# Altium schematic sheet DRIVERv1.4.SchDoc
size A4
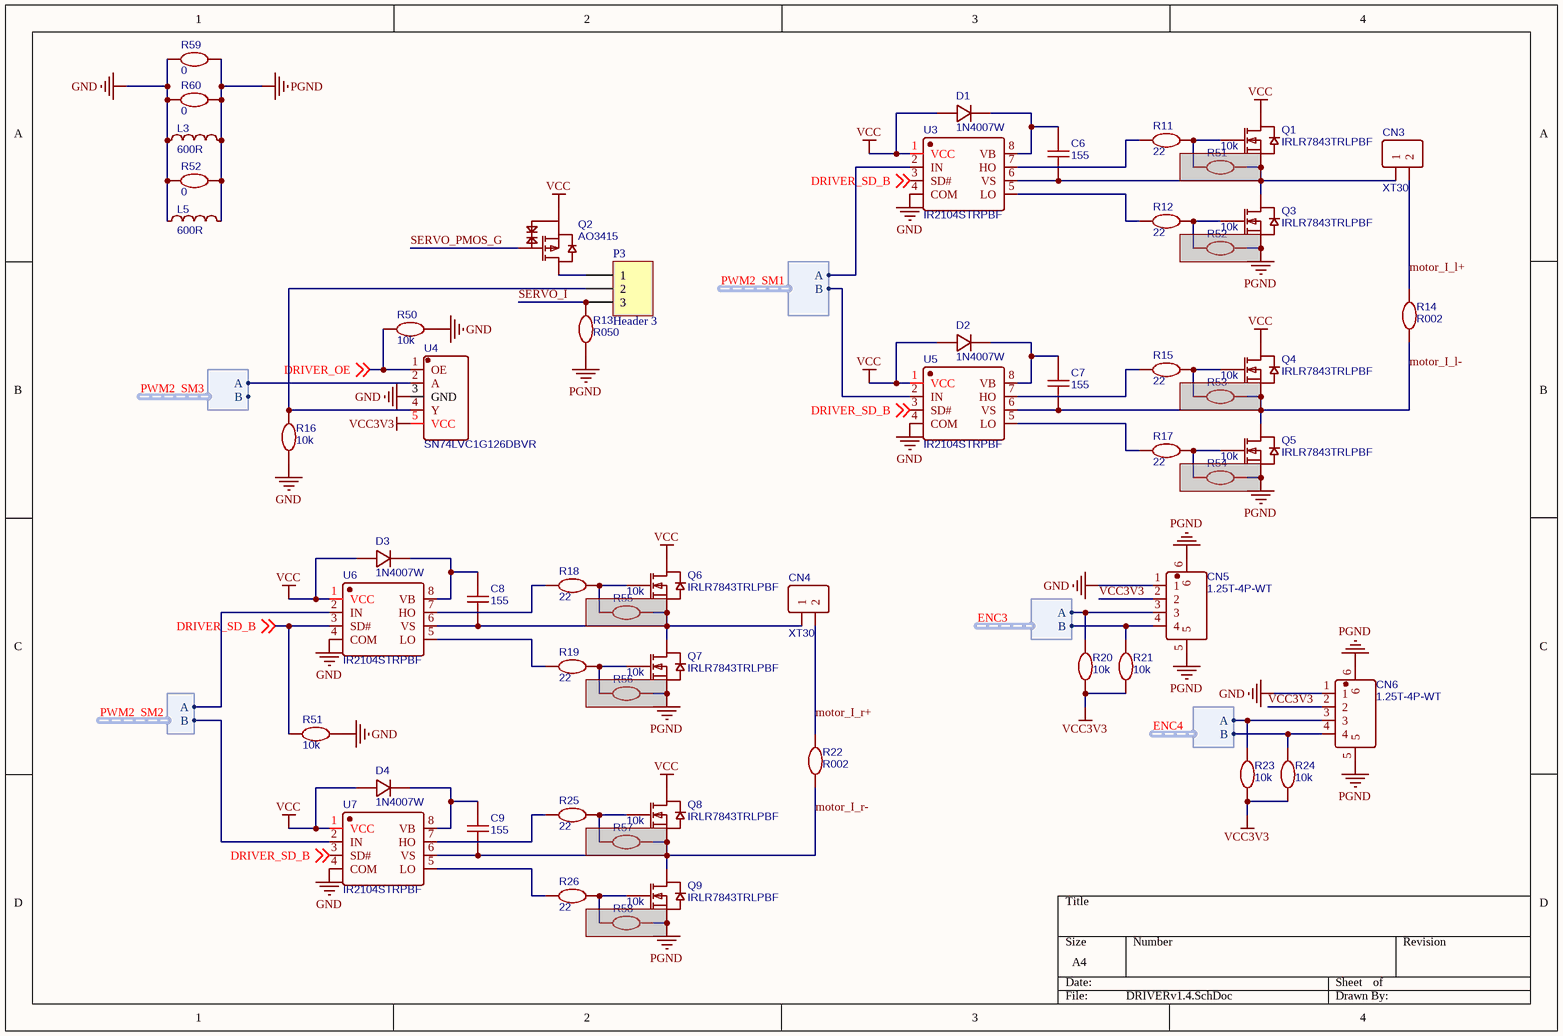
[diagram p0: DRIVERv1.4.SchDoc]

## Parts
(Parts that share a designator on the sheet are numbered #1, #2 ... from top to bottom, then left to right.)
C6  155  [C0603]
C7  155  [C0603]
C8  155  [C0603]
C9  155  [C0603]
CN3  XT30  [CONN-TH_XT30UPB-F]
CN4  XT30  [CONN-TH_XT30UPB-F]
CN5  1.25T-4P-WT  [CONN-SMD_4P-1.25P_1.25T-4P]
CN6  1.25T-4P-WT  [CONN-SMD_4P-1.25P_1.25T-4P]
D1  1N4007W  [SOD-123_L2.8-W1.8-LS3.7-RD]
D2  1N4007W  [SOD-123_L2.8-W1.8-LS3.7-RD]
D3  1N4007W  [SOD-123_L2.8-W1.8-LS3.7-RD]
D4  1N4007W  [SOD-123_L2.8-W1.8-LS3.7-RD]
L3  600R  [L0603]
L5  600R  [L0603]
P3  Header 3  [HDR1X3]
Q1  IRLR7843TRLPBF  [DPAK_L6.5-W6.0-P2.29-LS9.9-TL]
Q2  AO3415  [SOT-23-3_L2.9-W1.3-P1.90-LS2.4-BR]
Q3  IRLR7843TRLPBF  [DPAK_L6.5-W6.0-P2.29-LS9.9-TL]
Q4  IRLR7843TRLPBF  [DPAK_L6.5-W6.0-P2.29-LS9.9-TL]
Q5  IRLR7843TRLPBF  [DPAK_L6.5-W6.0-P2.29-LS9.9-TL]
Q6  IRLR7843TRLPBF  [DPAK_L6.5-W6.0-P2.29-LS9.9-TL]
Q7  IRLR7843TRLPBF  [DPAK_L6.5-W6.0-P2.29-LS9.9-TL]
Q8  IRLR7843TRLPBF  [DPAK_L6.5-W6.0-P2.29-LS9.9-TL]
Q9  IRLR7843TRLPBF  [DPAK_L6.5-W6.0-P2.29-LS9.9-TL]
R11  22  [R0603]
R12  22  [R0603]
R13  R050  [R2010]
R14  R002  [R2010]
R15  22  [R0603]
R16  10k  [R0603]
R17  22  [R0603]
R18  22  [R0603]
R19  22  [R0603]
R20  10k  [R0603]
R21  10k  [R0603]
R22  R002  [R2010]
R23  10k  [R0603]
R24  10k  [R0603]
R25  22  [R0603]
R26  22  [R0603]
R50  10k  [R0603]
R51#1  10k  [R0603]  (masked out: inside a compile mask, not in the netlist)
R51#2  10k  [R0603]
R52#1  0  [R0603]
R52#2  10k  [R0603]  (masked out: inside a compile mask, not in the netlist)
R53  10k  [R0603]  (masked out: inside a compile mask, not in the netlist)
R54  10k  [R0603]  (masked out: inside a compile mask, not in the netlist)
R55  10k  [R0603]  (masked out: inside a compile mask, not in the netlist)
R56  10k  [R0603]  (masked out: inside a compile mask, not in the netlist)
R57  10k  [R0603]  (masked out: inside a compile mask, not in the netlist)
R58  10k  [R0603]  (masked out: inside a compile mask, not in the netlist)
R59  0  [R0603]
R60  0  [R0603]
U3  IR2104STRPBF  [SOIC-8_L4.9-W3.9-P1.27-LS6.0-BL]
U4  SN74LVC1G126DBVR  [SOT-23-5_L3.0-W1.7-P0.95-LS2.8-BR]
U5  IR2104STRPBF  [SOIC-8_L4.9-W3.9-P1.27-LS6.0-BL]
U6  IR2104STRPBF  [SOIC-8_L4.9-W3.9-P1.27-LS6.0-BL]
U7  IR2104STRPBF  [SOIC-8_L4.9-W3.9-P1.27-LS6.0-BL]

## Harnesses
ENC: A, B
PWM_SM: A, B

## Nets
GND: CN5.1 CN6.1 L3.1 L5.1 R16.1 R50.1 R51#2.1 R52#1.1 R59.1 R60.1 U3.4(COM) U4.3(GND) U5.4(COM) U6.4(COM) U7.4(COM)
PGND: CN5.5 CN5.6 CN6.5 CN6.6 L3.2 L5.2 R13.1 R52#1.2 R59.2 R60.2
VCC: D1.2 D2.2 D3.2 D4.2 Q1.4(D) Q2.2(S) Q4.4(D) Q6.4(D) Q8.4(D) U3.1(VCC) U5.1(VCC) U6.1(VCC) U7.1(VCC)
VCC3V3: CN5.2 CN6.2 R20.1 R21.1 R23.1 R24.1 U4.5(VCC)
DRIVER_OE: R50.2 U4.1(OE) ; off-sheet DRIVER_OE
DRIVER_SD_B: R51#2.2 U3.3(SD#) U5.3(SD#) U6.3(SD#) U7.3(SD#) ; off-sheet DRIVER_SD_B
ENC3.A: CN5.3 R20.2 ; harness ENC.A
ENC3.B: CN5.4 R21.2 ; harness ENC.B
ENC4.A: CN6.3 R23.2 ; harness ENC.A
ENC4.B: CN6.4 R24.2 ; harness ENC.B
motor_I_l+: CN3.2 R14.2
motor_I_l-: C7.1 Q4.3(S) Q5.4(D) R14.1 U5.6(VS)
motor_I_r+: CN4.2 R22.2
motor_I_r-: C9.1 Q8.3(S) Q9.4(D) R22.1 U7.6(VS)
PWM2_SM1.A: U3.2(IN) ; harness PWM_SM.A
PWM2_SM1.B: U5.2(IN) ; harness PWM_SM.B
PWM2_SM2.A: U6.2(IN) ; harness PWM_SM.A
PWM2_SM2.B: U7.2(IN) ; harness PWM_SM.B
PWM2_SM3.A: U4.2(A) ; harness PWM_SM.A
SERVO_I: P3.3 R13.2
SERVO_PMOS_G: Q2.1(G)
NetC6_1: C6.1 CN3.1 Q1.3(S) Q3.4(D) U3.6(VS)
NetC6_2: C6.2 D1.1 U3.8(VB)
NetC7_2: C7.2 D2.1 U5.8(VB)
NetC8_1: C8.1 CN4.1 Q6.3(S) Q7.4(D) U6.6(VS)
NetC8_2: C8.2 D3.1 U6.8(VB)
NetC9_2: C9.2 D4.1 U7.8(VB)
NetP3_1: P3.1 Q2.3(D)
NetP3_2: P3.2 R16.2 U4.4(Y)
NetQ1_1: Q1.1(G) R11.2
NetQ3_1: Q3.1(G) R12.2
NetQ4_1: Q4.1(G) R15.2
NetQ5_1: Q5.1(G) R17.2
NetQ6_1: Q6.1(G) R18.2
NetQ7_1: Q7.1(G) R19.2
NetQ8_1: Q8.1(G) R25.2
NetQ9_1: Q9.1(G) R26.2
NetR11_1: R11.1 U3.7(HO)
NetR12_1: R12.1 U3.5(LO)
NetR15_1: R15.1 U5.7(HO)
NetR17_1: R17.1 U5.5(LO)
NetR18_1: R18.1 U6.7(HO)
NetR19_1: R19.1 U6.5(LO)
NetR25_1: R25.1 U7.7(HO)
NetR26_1: R26.1 U7.5(LO)

Not connected (* = marked no-connect by the designer): Q3 3(S); Q5 3(S); Q7 3(S); Q9 3(S)

## Library data of the parts
C6-C9 = C0603: nameAlias: Value(F); Contributor: LCEDA_Lib; spicePre: C; spiceSymbolName: C_0603_US
CN3 CN4 = XT30: BOM_Manufacturer: Changzhou Amass Elec; BOM_Manufacturer Part: XT30UPB-F; nameAlias: Value; Contributor: LCSC; BOM_Supplier: LCSC; BOM_Supplier Part: C108769; spicePre: C; spiceSymbolName: XT30UPB-F
CN5 CN6 = 1.25T-4P-WT: BOM_Manufacturer: HRO; Contributor: LCSC; BOM_Supplier: LCSC; BOM_Manufacturer Part: 1.25T-4P-WT; BOM_Supplier Part: C125739; spicePre: C; spiceSymbolName: 1.25T-4P-WT
D1-D4 = 1N4007W: BOM_Manufacturer: BLUE ROCKET; Contributor: LCEDA_Lib; BOM_Supplier: LCSC; BOM_Supplier Part: C328592; BOM_Manufacturer Part: 1N4007W; spicePre: D; spiceSymbolName: 1N4007W
L3 L5 = L0603: nameAlias: Value(H); Contributor: LCEDA_Lib; spicePre: L; spiceSymbolName: L0603_US
P3 = Header 3: Header, 3-Pin; LatestRevisionDate: 17-Jul-2002; LatestRevisionNote: Re-released for DXP Platform.; Publisher: Altium Limited
Q1 Q3-Q9 = IRLR7843TRLPBF: BOM_Manufacturer: Infineon Technologies; Contributor: LCSC; BOM_Supplier: LCSC; BOM_Supplier Part: C538178; BOM_Manufacturer Part: IRLR7843TRLPBF; spicePre: Q; spiceSymbolName: IRLR7843TRLPBF
Q2 = AO3415: BOM_Manufacturer: AOS; SMT Type: Extend; BOM_Supplier: LCSC; BOM_Manufacturer Part: AO3415; image: //image.lceda.cn/szlcsc/C14354.jpg; BOM_Supplier Part: C14354; BOM_LCSC Assembly: Yes; spicePre: Q; spiceSymbolName: AO3415
R11 R12 R15-R21 R23-R26 R50 R51#1 R51#2 R52#1 R52#2 R53-R60 = R0603: nameAlias: Value(Ω); Contributor: LCEDA_Lib; spicePre: R; spiceSymbolName: R_0603_EU
R13 R14 R22 = R2010: nameAlias: Value(Ω); Contributor: LCEDA_Lib; spicePre: R; spiceSymbolName: R_2010_EU
U3 U5-U7 = IR2104STRPBF: BOM_Manufacturer: IR; SMT Type: Extend; spicePre: X; BOM_Supplier: LCSC; BOM_Manufacturer Part: IR2104STRPBF; image: //image.lceda.cn/szlcsc/C2960.jpg; BOM_Supplier Part: C2960; BOM_LCSC Assembly: Yes; spiceSymbolName: IR2104STRPBF
U4 = SN74LVC1G126DBVR: BOM_Manufacturer: TI; SMT Type: Extend; BOM_Supplier: LCSC; BOM_Manufacturer Part: SN74LVC1G126DBVR; image: //image.lceda.cn/szlcsc/C7834.jpg; BOM_Supplier Part: C7834; BOM_LCSC Assembly: Yes; spicePre: U; spiceSymbolName: SN74LVC1G126DBVR